# EasyEDA schematic SCH_VisionInspect-S3_2026-02-28.json
TITLE: VisionInspect-S3; REV: 1.0; Date: 2026-02-28; Sheet: 1/1; Drawn By: namhahuy0510; Company: namhahuy0510
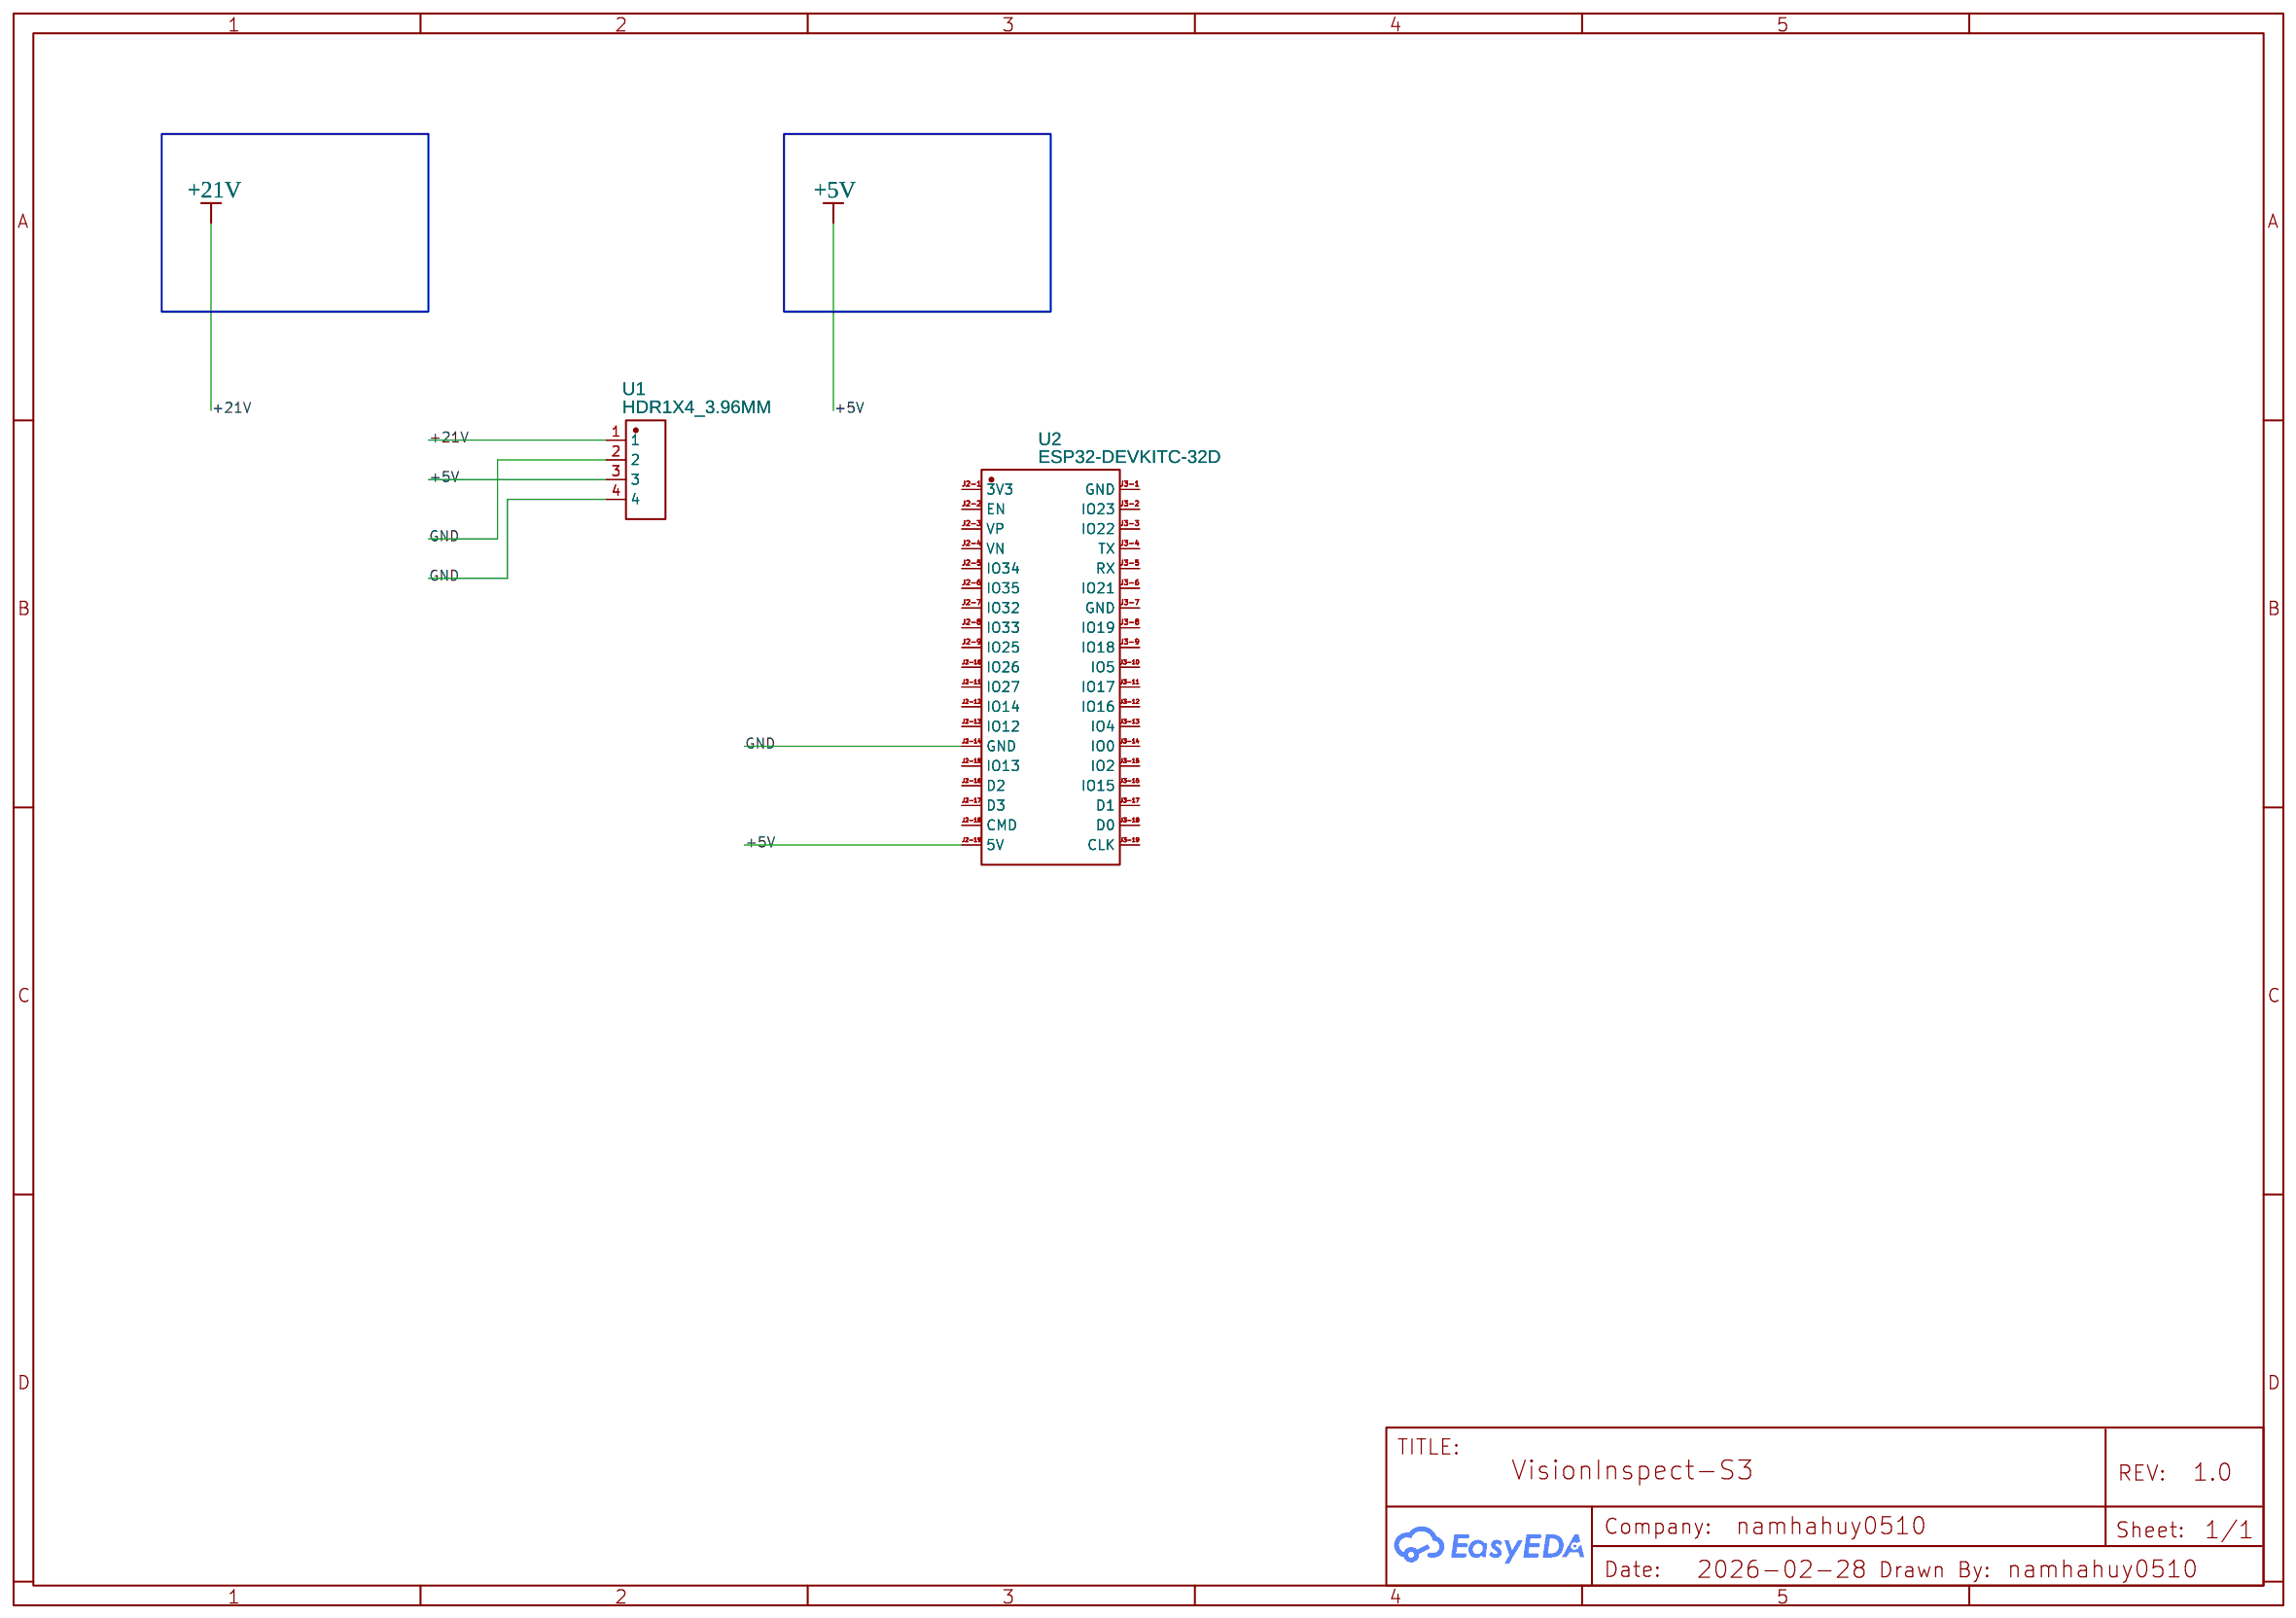
[diagram p0: schematic sheet]

## Parts
U1  HDR1X4_3.96MM  [CONN-TH_4P-P3.96_FWF39601-S04S22W1B]
U2  ESP32-DEVKITC-32D  [COMM-SMD_ESP32-DEVKITC-32D]

## Library data of the parts
U1 = HDR1X4_3.96MM: Contributor: LCSC; Supplier: LCSC; Supplier Part: C9900002236; Manufacturer: null; Manufacturer Part: HDR1X4_3.96mm; JLCPCB Part Class: Extended Part
U2 = ESP32-DEVKITC-32D: Supplier: LCSC; Supplier Part: C571181; Manufacturer: ESPRESSIF(乐鑫); Manufacturer Part: ESP32-DevKitC-32D; Contributor: lcsc

## Nets
+5V: U1.3 U2.J2-19(5V)
+21V: U1.1
GND: U1.2 U1.4 U2.J2-14(GND)

Not connected (* = marked no-connect by the designer): U2 J2-1(3V3) J2-2(EN) J2-3(VP) J2-4(VN) J2-5(IO34) J2-6(IO35) J2-7(IO32) J2-8(IO33) J2-9(IO25) J2-10(IO26) J2-11(IO27) J2-12(IO14) J2-13(IO12) J2-15(IO13) J2-16(D2) J2-17(D3) J2-18(CMD) J3-1(GND) J3-2(IO23) J3-3(IO22) J3-4(TX) J3-5(RX) J3-6(IO21) J3-7(GND) J3-8(IO19) J3-9(IO18) J3-10(IO5) J3-11(IO17) J3-12(IO16) J3-13(IO4) J3-14(IO0) J3-15(IO2) J3-16(IO15) J3-17(D1) J3-18(D0) J3-19(CLK)
